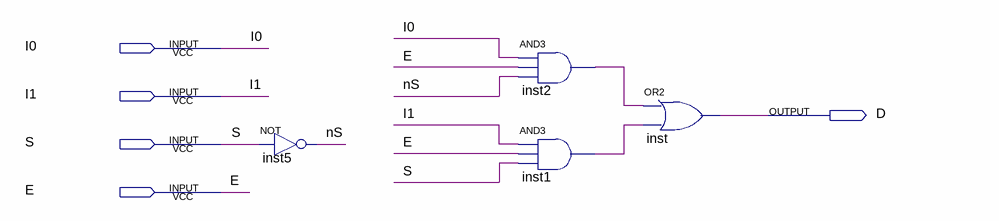
[diagram p0: schematic sheet]
// Quartus schematic MPX2.bdf as structural Verilog: 4 symbols, 5 pins
module MPX2 (
  input  I0,
  input  I1,
  input  S,
  input  E,
  output D
);

  wire inst1_out, inst2_out, nS;

  not inst5 (nS, S);
  and inst2 (inst2_out, I0, E, nS);
  and inst1 (inst1_out, I1, E, S);
  or inst (D, inst2_out, inst1_out);
endmodule
